# Altium schematic sheet Sheet1.SchDoc
size A4; SheetNumber: 1; SheetTotal: 1
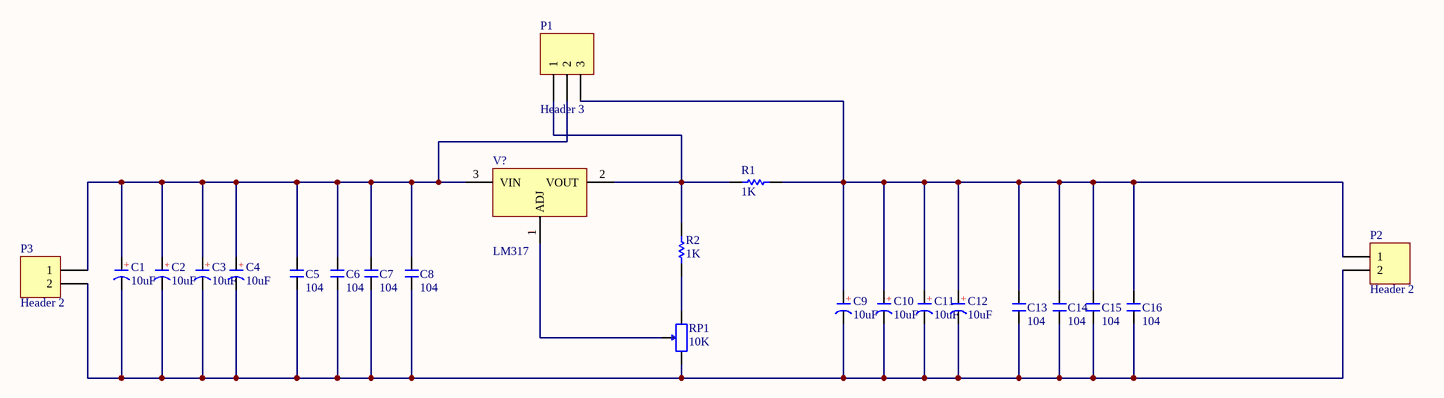
[diagram p0: Sheet1.SchDoc]

## Parts
C1  10uF  [CAP 2.0*5*11]
C2  10uF  [CAP 2.0*5*11]
C3  10uF  [CAP 2.0*5*11]
C4  10uF  [CAP 2.0*5*11]
C5  104  [C 0805_M]
C6  104  [C 0805_M]
C7  104  [C 0805_M]
C8  104  [C 0805_M]
C9  10uF  [CAP 2.0*5*11]
C10  10uF  [CAP 2.0*5*11]
C11  10uF  [CAP 2.0*5*11]
C12  10uF  [CAP 2.0*5*11]
C13  104  [C 0805_M]
C14  104  [C 0805_M]
C15  104  [C 0805_M]
C16  104  [C 0805_M]
P1  Header 3  [HDR1X3]
P2  Header 2  [HDR1X2]
P3  Header 2  [HDR1X2]
R1  1K  [RS 1/4W]
R2  1K  [RS 1/4W]
RP1  10K  [WH148-1-G15]
V?  LM317  [TO220A]

## Nets
NetC1_1: C1.1(A) C2.1(A) C3.1(A) C4.1(A) C5.2 C6.2 C7.2 C8.2 P1.2 P3.1 V?.3(VIN)
NetC1_2: C1.2(K) C2.2(K) C3.2(K) C4.2(K) C5.1 C6.1 C7.1 C8.1 C9.2(K) C10.2(K) C11.2(K) C12.2(K) C13.1 C14.1 C15.1 C16.1 P2.2 P3.2 RP1.1
NetC9_1: C9.1(A) C10.1(A) C11.1(A) C12.1(A) C13.2 C14.2 C15.2 C16.2 P1.3 P2.1 R1.1
NetP1_1: P1.1 R1.2 R2.2 V?.2(VOUT)
NetR2_1: R2.1 RP1.3
NetRP1_2: RP1.2 V?.1(ADJ)

## Notes on the sheet
- (in symbol CE) +

## Library data of the parts
C1-C4 C9-C12 = CE: 直插电解电容; 淘宝ID: 小糖豆的小窝窝; BOM名称: 直插电解电容; 下单链接: https://item.taobao.com/item.htm?ft=t&id=613637044352
C5-C8 C13-C16 = C: 贴片电容; 淘宝ID: 小糖豆的小窝窝; BOM名称: 贴片电容; 下单链接: https://item.taobao.com/item.htm?ft=t&id=613637044352
P1 = Header 3: Header, 3-Pin; LatestRevisionDate: 17-Jul-2002; LatestRevisionNote: Re-released for DXP Platform.; Publisher: Altium Limited
P2 P3 = Header 2: Header, 2-Pin; LatestRevisionDate: 17-Jul-2002; LatestRevisionNote: Re-released for DXP Platform.; Publisher: Altium Limited
R1 R2 = Res: 色环电阻; 淘宝ID: 小糖豆的小窝窝; BOM名称: 色环电阻; 下单链接: https://item.taobao.com/item.htm?ft=t&id=613637044352
RP1 = RP: 单联电位器; 淘宝ID: 小糖豆的小窝窝; BOM名称: 单联电位器; 下单链接: https://item.taobao.com/item.htm?ft=t&id=613637044352
V? = LM317: 可调线性稳压芯片; 淘宝ID: 小糖豆的小窝窝; BOM名称: 可调线性稳压芯片; 下单链接: https://item.taobao.com/item.htm?ft=t&id=613637044352